# EAGLE design DevControl (EAGLE 9.4.2)
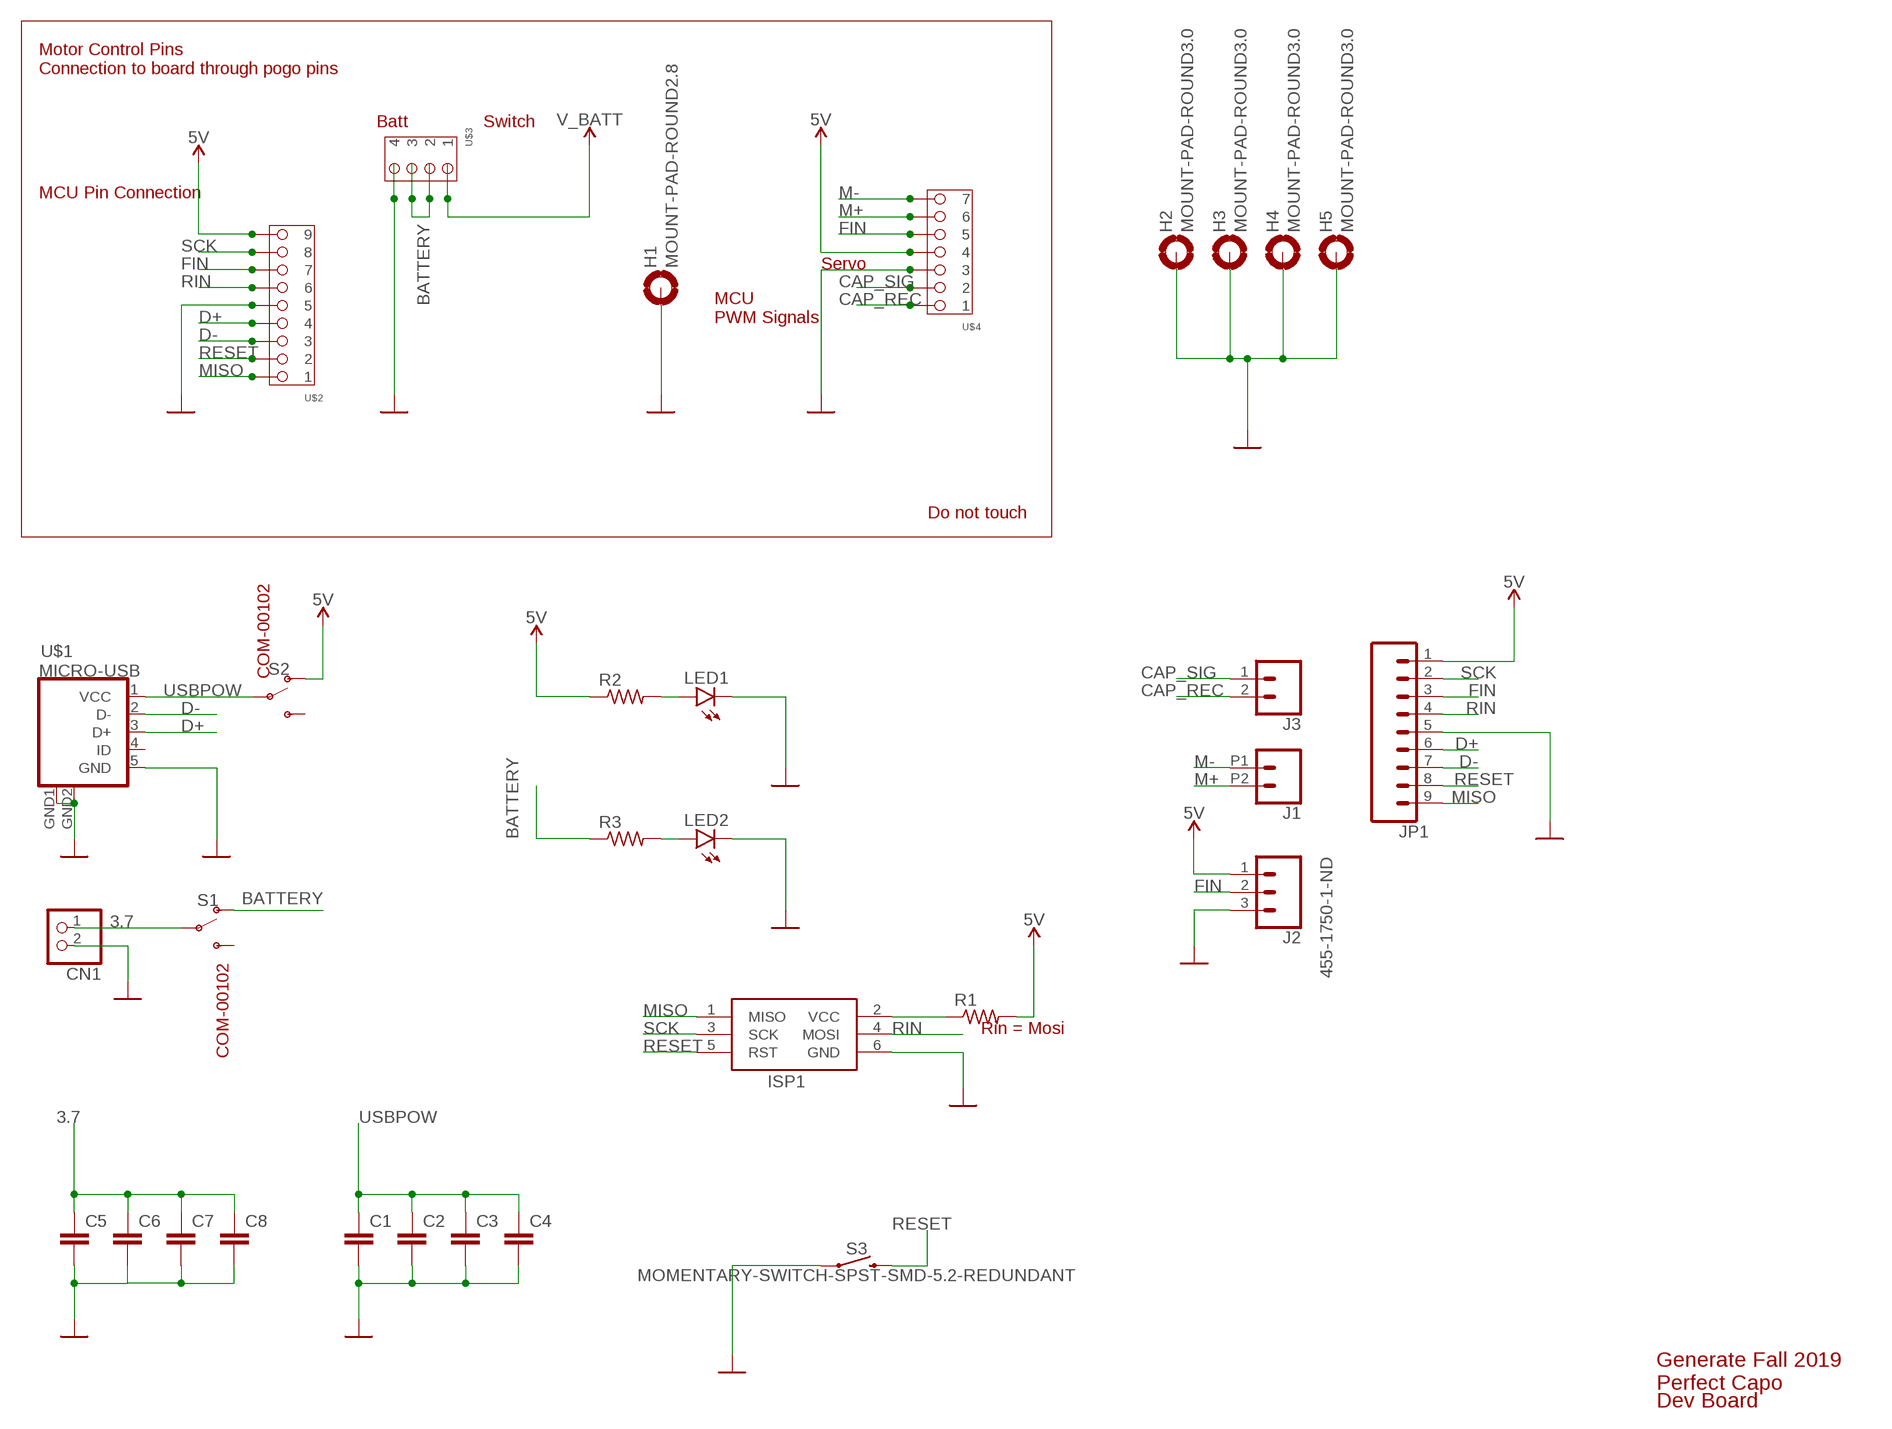
[diagram p0: schematic, sheet 1]

## Parts
C1  C-EUC0805  [C0805]
C2  C-EUC0805  [C0805]
C3  C-EUC0805  [C0805]
C4  C-EUC0805  [C0805]
C5  C-EUC0805  [C0805]
C6  C-EUC0805  [C0805]
C7  C-EUC0805  [C0805]
C8  C-EUC0805  [C0805]
CN1  JST_2PIN-SMT-RA  [JST-PH-2-SMT-RA]
H1  MOUNT-PAD-ROUND2.8  [2,8-PAD]
H2  MOUNT-PAD-ROUND3.0  [3,0-PAD]
H3  MOUNT-PAD-ROUND3.0  [3,0-PAD]
H4  MOUNT-PAD-ROUND3.0  [3,0-PAD]
H5  MOUNT-PAD-ROUND3.0  [3,0-PAD]
ISP1  AVRISP-6  [AVRISP]
J1  CONN_022.54MM_SCREWTERM  [1X02_2.54_SCREWTERM]
J2  455-1750-1-ND  CONN_03  [1X03]
J3  CONN_02  [1X02]
JP1  CONN_09  [1X09]
LED1  LEDCHIPLED_0805  [CHIPLED_0805]
LED2  LEDCHIPLED_0805  [CHIPLED_0805]
R1  R-US_R0805  [R0805]
R2  R-US_R0805  [R0805]
R3  R-US_R0805  [R0805]
S1  SWITCH-SPDT-PTH-11.6X4.0MM  [SWITCH_SPDT_PTH_11.6X4.0MM]
S2  SWITCH-SPDT-PTH-11.6X4.0MM  [SWITCH_SPDT_PTH_11.6X4.0MM]
S3  MOMENTARY-SWITCH-SPST-SMD-5.2-REDUNDANT  [TACTILE_SWITCH_SMD_5.2MM]
U$1  MICRO-USB  [MICRO-USB]
U$2  POGO-1X9  [POGO-1X9]
U$3  POGO-1X4  [POGO-1X4]
U$4  POGO-1X7  [POGO-1X7]

## Nets
3.7: C5.1 C6.1 C7.1 C8.1 CN1.1 S1.2(P)
5V: J2.1 JP1.1 R1.2 R2.1 S2.1(O) U$2.P$9 U$4.P$4
BATTERY: R3.1 S1.1(O) U$3.P$2 U$3.P$3
CAP_REC: J3.2 U$4.P$1
CAP_SIG: J3.1 U$4.P$2
D+: JP1.6 U$1.3(D+) U$2.P$4
D-: JP1.7 U$1.2(D-) U$2.P$3
FIN: J2.2 JP1.3 U$2.P$7 U$4.P$5
GND: C1.2 C2.2 C3.2 C4.2 C5.2 C6.2 C7.2 C8.2 CN1.2 H1.B2,8(MOUNT) H2.B3,0(MOUNT) H3.B3,0(MOUNT) H4.B3,0(MOUNT) H5.B3,0(MOUNT) ISP1.6(GND) J2.3 JP1.5 LED1.C LED2.C S3.1 S3.2 U$1.5(GND) U$1.GND1(GND) U$1.GND2(GND) U$2.P$5 U$3.P$4 U$4.P$3
M+: J1.P2 U$4.P$6
M-: J1.P1 U$4.P$7
MISO: ISP1.1(MISO) JP1.9 U$2.P$1
N$1: ISP1.2(VCC) R1.1
N$2: LED1.A R2.2
N$6: LED2.A R3.2
RESET: ISP1.5(RST) JP1.8 S3.3 S3.4 U$2.P$2
RIN: ISP1.4(MOSI) JP1.4 U$2.P$6
SCK: ISP1.3(SCK) JP1.2 U$2.P$8
USBPOW: C1.1 C2.1 C3.1 C4.1 S2.2(P) U$1.1(VCC)
V_BATT: U$3.P$1
Unconnected: S1.3(S) S2.3(S) U$1.4(ID)

## Notes on the sheet
- Motor Control Pins
  Connection to board through pogo pins
- Batt | Switch
- MCU Pin Connection
- Servo
- MCU
  PWM Signals
- Do not touch
- COM-00102
- COM-00102
- Rin = Mosi
- Generate Fall 2019
  Perfect Capo
- Dev Board

## Library data of the parts
C1-C8 = rcl:C-EU: CAPACITOR, European symbol; SPICEPREFIX: C
CN1 = adafruit:JST_2PIN: JST 2-Pin Connectors of various flavors SMT-RA (S2B-PH-SM4) 4UConnector #17311 SMT (B2B-PH-SM4) THM-RA (S2B-PH) THM (B2B-PH)
H1-H5 = holes:MOUNT-PAD-ROUND: MOUNTING PAD, round
ISP1 = adafruit:AVRISP: AVR ISP HEADER Standard 6 pin header for AVR programming
J1 J3 = SparkFun-Connectors:CONN_02: Multi connection point. Often used as Generic Header-pin footprint for 0.1 inch spaced/style header connections On any of the 0.1 inch spaced packages, you can populate with these: Break Away Headers - Straight <https://www.sparkfun.com/products/116> (PRT-00116) Break Away Male Headers - Right Angle <https://www.sparkfun.com/products/553> (PRT-00553) Female Headers <https://www.sparkfun.com/products/115> (PRT-00115) Break Away Headers - Machine Pin <https://www.sparkfun.com/products/117> (PRT-00117) Break Away Female Headers - Swiss Machine Pin <https://www.sparkfun.com/products/743> (PRT-00743) For SCREWTERMINALS and SPRING TERMINALS visit here: Screw Terimnals on SparkFun.com <https://www.sparkfun.com/search/results?term=Screw+Terminals> (5mm/3.5mm/2.54mm spacing) This device is also useful as a general connection point to wire up your design to another part of your project. Our various solder wires solder well into these plated through hole pads. Hook-Up Wire - Assortment (Stranded, 22 AWG) <https://www.sparkfun.com/products/11375> (PRT-11375) Hook-Up Wire - Assortment (Solid Core, 22 AWG) <https://www.sparkfun.com/products/11367> (PRT-11367) View the entire wire category on our website here <https://www.sparkfun.com/categories/141> Special notes: Molex polarized connector foot print use with: PRT-08233 with associated crimp pins and housings. 2.54_SCREWTERM for use with PRT-10571. 3.5mm Screw Terminal footprints for PRT-08084 5mm Screw Terminal footprints for use with PRT-08432
J2 = SparkFun-Connectors:CONN_03: Multi connection point. Often used as Generic Header-pin footprint for 0.1 inch spaced/style header connections On any of the 0.1 inch spaced packages, you can populate with these: Break Away Headers - Straight <https://www.sparkfun.com/products/116> (PRT-00116) Break Away Male Headers - Right Angle <https://www.sparkfun.com/products/553> (PRT-00553) Female Headers <https://www.sparkfun.com/products/115> (PRT-00115) Break Away Headers - Machine Pin <https://www.sparkfun.com/products/117> (PRT-00117) Break Away Female Headers - Swiss Machine Pin <https://www.sparkfun.com/products/743> (PRT-00743) Stackable Header - 3 Pin (Female, 0.1") <https://www.sparkfun.com/products/13875> (PRT-13875) For SCREWTERMINALS and SPRING TERMINALS visit here: Screw Terimnals on SparkFun.com <https://www.sparkfun.com/search/results?term=Screw+Terminals> (5mm/3.5mm/2.54mm spacing) This device is also useful as a general connection point to wire up your design to another part of your project. Our various solder wires solder well into these plated through hole pads. Hook-Up Wire - Assortment (Stranded, 22 AWG) <https://www.sparkfun.com/products/11375> (PRT-11375) Hook-Up Wire - Assortment (Solid Core, 22 AWG) <https://www.sparkfun.com/products/11367> (PRT-11367) View the entire wire category on our website here <https://www.sparkfun.com/categories/141> Special notes: Molex polarized connector foot print use with SKU : PRT-08232 with associated crimp pins and housings.; PROD_ID: XXX-00000
JP1 = SparkFun-Connectors:CONN_09: Multi connection point. Often used as Generic Header-pin footprint for 0.1 inch spaced/style header connections On any of the 0.1 inch spaced packages, you can populate with these: Break Away Headers - Straight <https://www.sparkfun.com/products/116> (PRT-00116) Break Away Male Headers - Right Angle <https://www.sparkfun.com/products/553> (PRT-00553) Female Headers <https://www.sparkfun.com/products/115> (PRT-00115) Break Away Headers - Machine Pin <https://www.sparkfun.com/products/117> (PRT-00117) Break Away Female Headers - Swiss Machine Pin <https://www.sparkfun.com/products/743> (PRT-00743) For SCREWTERMINALS and SPRING TERMINALS visit here: Screw Terimnals on SparkFun.com <https://www.sparkfun.com/search/results?term=Screw+Terminals> (5mm/3.5mm/2.54mm spacing) This device is also useful as a general connection point to wire up your design to another part of your project. Our various solder wires solder well into these plated through hole pads. Hook-Up Wire - Assortment (Stranded, 22 AWG) <https://www.sparkfun.com/products/11375> (PRT-11375) Hook-Up Wire - Assortment (Solid Core, 22 AWG) <https://www.sparkfun.com/products/11367> (PRT-11367) View the entire wire category on our website here <https://www.sparkfun.com/categories/141> Special notes: Molex polarized connector foot print use with SKU : PRT-08231 with associated crimp pins and housings. 1MM SMD Version SKU: PRT-10208 NOTES ON THE VARIANTS LOCK and LOCK_LONGPADS... This footprint was designed to help hold the alignment of a through-hole component (i.e. 6-pin header) while soldering it into place. You may notice that each hole has been shifted either up or down by 0.005 of an inch from it's more standard position (which is a perfectly straight line). This slight alteration caused the pins (the squares in the middle) to touch the edges of the holes. Because they are alternating, it causes a "brace" to hold the component in place. 0.005 has proven to be the perfect amount of "off-center" position when using our standard breakaway headers. Although looks a little odd when you look at the bare footprint, once you have a header in there, the alteration is very hard to notice. Also,if you push a header all the way into place, it is covered up entirely on the bottom side.
LED1 LED2 = led:LED: LED OSRAM: - CHIPLED LG R971, LG N971, LY N971, LG Q971, LY Q971, LO R971, LY R971 LH N974, LH R974 LS Q976, LO Q976, LY Q976 LO Q996 - Hyper CHIPLED LW Q18S LB Q993, LB Q99A, LB R99A - SideLED LS A670, LO A670, LY A670, LG A670, LP A670 LB A673, LV A673, LT A673, LW A673 LH A674 LY A675 LS A676, LA A676, LO A676, LY A676, LW A676 LS A679, LY A679, LG A679 - Hyper Micro SIDELED® LS Y876, LA Y876, LO Y876, LY Y876 LT Y87S - SmartLED LW L88C, LW L88S LB L89C, LB L89S, LG L890 LS L89K, LO L89K, LY L89K LS L896, LA L896, LO L896, LY L896 - TOPLED LS T670, LO T670, LY T670, LG T670, LP T670 LSG T670, LSP T670, LSY T670, LOP T670, LYG T670 LG T671, LOG T671, LSG T671 LB T673, LV T673, LT T673, LW T673 LH T674 LS T676, LA T676, LO T676, LY T676, LB T676, LH T676, LSB T676, LW T676 LB T67C, LV T67C, LT T67C, LS T67K, LO T67K, LY T67K, LW E67C LS E67B, LA E67B, LO E67B, LY E67B, LB E67C, LV E67C, LT E67C LW T67C LS T679, LY T679, LG T679 LS T770, LO T770, LY T770, LG T770, LP T770 LB T773, LV T773, LT T773, LW T773 LH T774 LS E675, LA E675, LY E675, LS T675 LS T776, LA T776, LO T776, LY T776, LB T776 LHGB T686 LT T68C, LB T68C - Hyper Mini TOPLED® LB M676 - Mini TOPLED Santana® LG M470 LS M47K, LO M47K, LY M47K Source: http://www.osram.convergy.de LUXEON: - LUMILED® LXK2-PW12-R00, LXK2-PW12-S00, LXK2-PW14-U00, LXK2-PW14-V00 LXK2-PM12-R00, LXK2-PM12-S00, LXK2-PM14-U00 LXK2-PE12-Q00, LXK2-PE12-R00, LXK2-PE12-S00, LXK2-PE14-T00, LXK2-PE14-U00 LXK2-PB12-K00, LXK2-PB12-L00, LXK2-PB12-M00, LXK2-PB14-N00, LXK2-PB14-P00, LXK2-PB14-Q00 LXK2-PR12-L00, LXK2-PR12-M00, LXK2-PR14-Q00, LXK2-PR14-R00 LXK2-PD12-Q00, LXK2-PD12-R00, LXK2-PD12-S00 LXK2-PH12-R00, LXK2-PH12-S00 LXK2-PL12-P00, LXK2-PL12-Q00, LXK2-PL12-R00 Source: www.luxeon.com KINGBRIGHT: KA-3528ASYC Source: www.kingbright.com
R1-R3 = rcl:R-US_: RESISTOR, American symbol; SPICEPREFIX: R
S1 S2 = SparkFun-Switches:SWITCH-SPDT: Single Pole, Double Throw (SPDT) Switch Single-pole, double-throw (SPDT) switch. Variant Overview SMD-AYZ0202 Surface Mount DPDT Switch <https://www.sparkfun.com/products/597> (COM-00597) Used on e.g. LilyPad Arduino USB - ATmega32U4 Board <https://www.sparkfun.com/products/12049> PTH-11.6X4.0MM SPDT Mini Power Switch <https://www.sparkfun.com/products/102> (COM-00102) Used on e.g. SparkFun Simon Says - Through-Hole Soldering Kit <https://www.sparkfun.com/products/10547> (KIT-10547) PTH-11.6X4.0MM-KIT KIT version of SPDT Mini Power Switch - Simplifies soldering by removing tStop of switch pins - only one side can be soldered. PTH-11.6X4.0MM-LOCK LOCK version of SPDT Mini Power Switch - Offset pins hold switch in place for easier soldering. SMD-RIGHT-ANGLE Surface Mount Right Angle Switch <https://www.sparkfun.com/products/10860> (COM-10860) Used on e.g. SparkFun ESP8266 Thing <https://www.sparkfun.com/products/13231>; PROD_ID: SWCH-08261; SF_SKU: COM-00102
S3 = SparkFun-Switches:MOMENTARY-SWITCH-SPST: Momentary Switch (Pushbutton) - SPST Normally-open (NO) SPST momentary switches (buttons, pushbuttons). Variants PTH-12MM - 12mm square, through-hole Momentary Pushbutton Switch - 12mm Square <https://www.sparkfun.com/products/9190> (COM-09190) PTH-6.0MM, PTH-6.0MM-KIT - 6.0mm square, through-hole Mini Pushbutton Switch <https://www.sparkfun.com/products/97> (COM-00097) KIT package intended for soldering kit's - only one side of pads' copper is exposed. PTH-RIGHT-ANGLE-KIT - Right-angle, through-hole Right Angle Tactile Button <https://www.sparkfun.com/products/10791> - Used on SparkFun BigTime Watch Kit <https://www.sparkfun.com/products/11734> SMD-12MM - 12mm square, surface-mount Tactile Button - SMD (12mm) <https://www.sparkfun.com/products/12993> (COM-12993) Used on SparkFun PicoBoard <https://www.sparkfun.com/products/11888> SMD-4.5MM - 4.5mm Square Trackball Switch Used on SparkFun Blackberry Trackballer Breakout <https://www.sparkfun.com/products/13169> SMD-4.6MMX2.8MM - 4.60mm x 2.80mm, surface mount Used on SparkFun SAMD21 Mini Breakout <https://www.sparkfun.com/products/13664> SMD-5.2MM, SMD-5.2-REDUNDANT - 5.2mm square, surface-mount Mini Pushbutton Switch - SMD <https://www.sparkfun.com/products/8720> (COM-08720) Used on Arduino Pro Mini <https://www.sparkfun.com/products/11114> REDUNDANT package connects both switch circuits together SMD-6.0X3.5MM - 6.0 x 3.5mm, surface mount Momentary Reset Switch SMD <https://www.sparkfun.com/products/8229> (COM-08229) SMD-6.2MM-TALL - 6.2mm square, surface mount Tactile Button - SMD (6mm) <https://www.sparkfun.com/products/12992> Used on SparkFun Digital Sandbox <https://www.sparkfun.com/products/12651> SMD-RIGHT-ANGLE - Right-angle, surface mount Used on SparkFun Block for Intel® Edison - Arduino <https://www.sparkfun.com/products/13036>; PROD_ID: SWCH-08247; SF_SKU: COM-08720
U$1 = MicroUSB:MICRO-USB: Micro USB B connector
U$2 = Nick's Personal Part:POGO-1X9
U$3 = Nick's Personal Part:POGO-1X4
U$4 = Nick's Personal Part:POGO-1X7

## Board
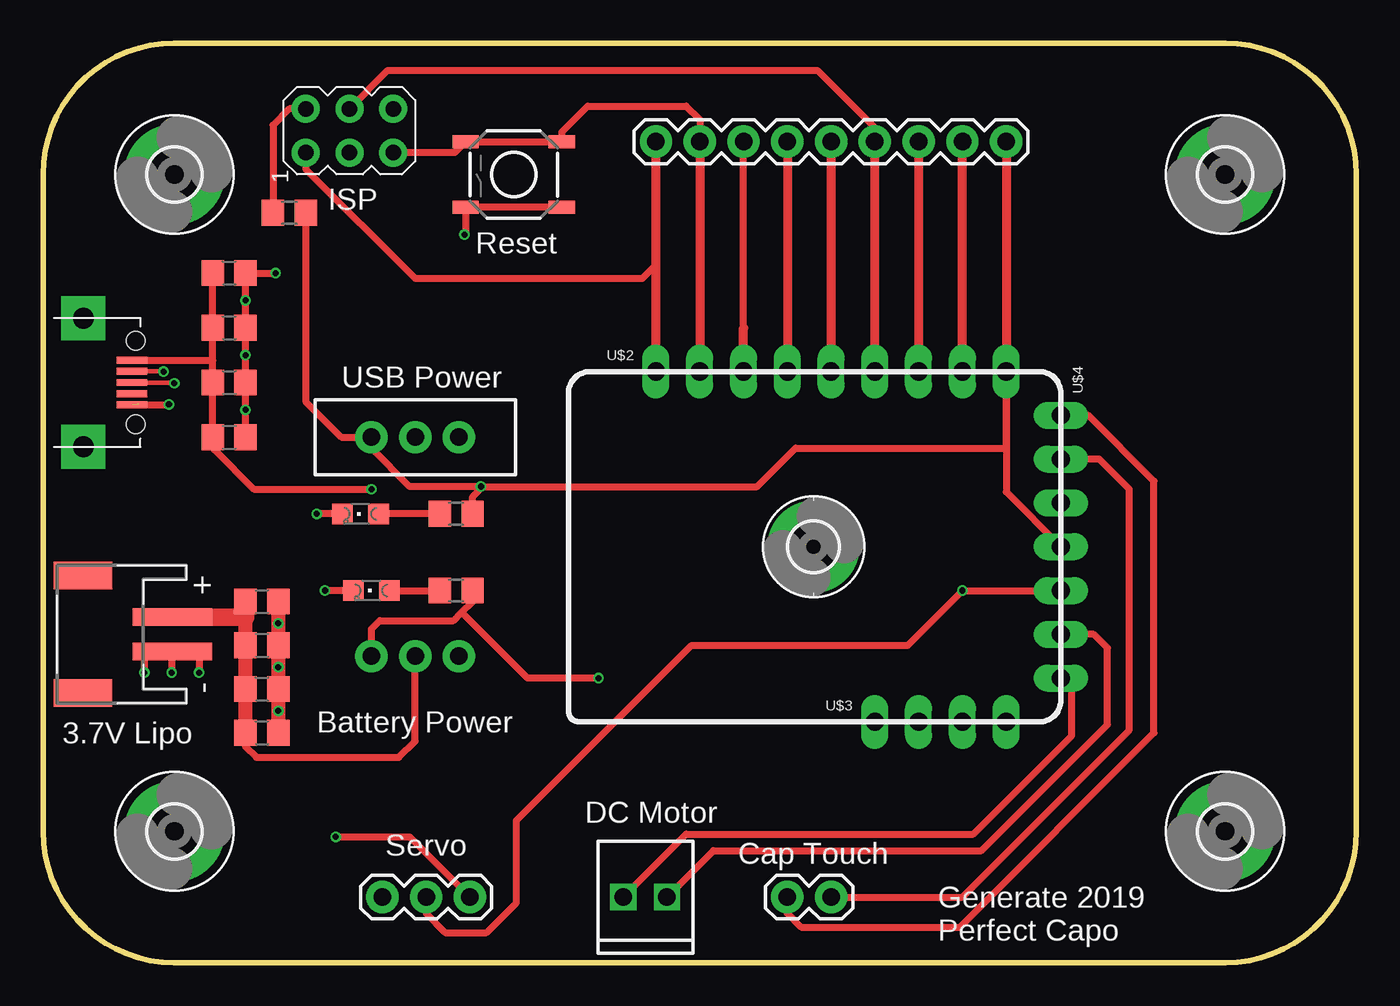
[diagram p1: board, top side]
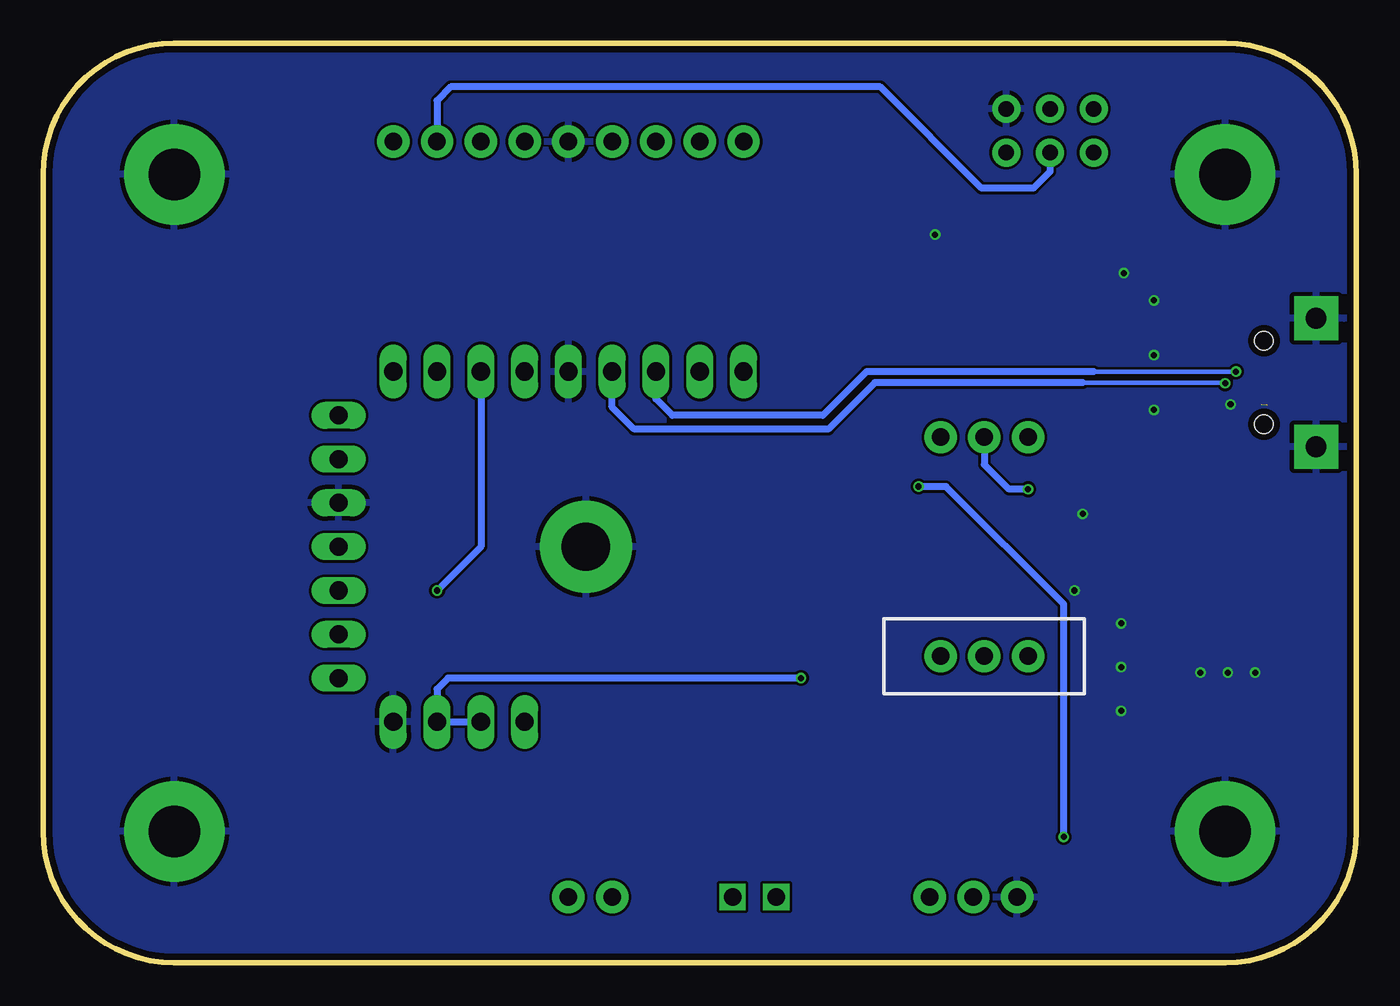
[diagram p2: board, bottom side, seen from below]

Size 76.2 x 53.34 mm. Coordinates in mm from the lower left corner, seen from the top.
Outline: 7.62,0 arc-90 0,7.62 0,45.72 arc-90 7.62,53.34 68.58,53.34 arc-90 76.2,45.72 76.2,7.62 arc-90 68.58,0 7.62,0
Copper layers (1*16): Top 0.035559375mm / dielectric 1.6mm / Bottom 0.035559375mm
Design rules "oshpark-2layer": minimum track width 6mil, minimum drill 10mil, track to track 6mil, track to pad 6mil, pad to pad 6mil, via to via 6mil, smd to smd 6mil, copper to edge 15mil, drill to drill 6mil, minimum pad ring 5mil, minimum via ring 5mil, stop-mask expansion 2.5mil, vias tented up to drill 0mil, thermal gap 10mil

### Footprints (pad centres in the part's own frame; a part is rotated, then mirrored left to right if it is on the bottom)
C0805 = smd 1.3 x 1.5: 1 -0.95,0; 2 0.95,0
JST-PH-2-SMT-RA = smd 1 x 4.6: 1 1,-3.7; 2 -1,-3.7 | smd 1.6 x 3.4: NC1 -3.4,1.5; NC2 3.4,1.5
2,8-PAD = drill 2.8 pad 5.334: B2,8 0,0
3,0-PAD = drill 3 pad 5.842: B3,0 0,0
AVRISP = drill 0.9 pad 1.626: 1 -1.27,2.54; 2 1.27,2.54; 3 -1.27,0; 4 1.27,0; 5 -1.27,-2.54; 6 1.27,-2.54
1X02_2.54_SCREWTERM = drill 1.016 square: P1 2.54,0; P2 0,0
1X03 = drill 1.016 pad 1.88: 1 0,0; 2 2.54,0; 3 5.08,0
1X02 = drill 1.016 pad 1.88: 1 0,0; 2 2.54,0
1X09 = drill 1.016 pad 1.88: 1 0,0; 2 2.54,0; 3 5.08,0; 4 7.62,0; 5 10.16,0; 6 12.7,0; 7 15.24,0; 8 17.78,0; 9 20.32,0
CHIPLED_0805 = smd 1.2 x 1.2: A 0,-1.05; C 0,1.05
R0805 = smd 1.3 x 1.5: 1 -0.95,0; 2 0.95,0
SWITCH_SPDT_PTH_11.6X4.0MM = drill 1.016 pad 1.88: 1 0,2.54; 2 0,0; 3 0,-2.54
TACTILE_SWITCH_SMD_5.2MM = smd 1.524 x 0.762: 1 -2.794,1.905; 2 2.794,1.905; 3 -2.794,-1.905; 4 2.794,-1.905
MICRO-USB = smd 0.4 x 1.75: 1 -1.3,4.525; 2 -0.65,4.525; 3 0,4.525; 4 0.65,4.525; 5 1.3,4.525 | drill 1.2 pad 2.54 square: GND1 -3.725,1.7; GND2 3.725,1.7 | hole 1.05: -2.425,4.73; 2.425,4.73
POGO-1X9 = drill 1.05 long: P$1 0,0; P$2 2.54,0; P$3 5.08,0; P$4 7.62,0; P$5 10.16,0; P$6 12.7,0; P$7 15.24,0; P$8 17.78,0; P$9 20.32,0
POGO-1X4 = drill 1.05 long: P$1 0,0; P$2 2.54,0; P$3 5.08,0; P$4 7.62,0
POGO-1X7 = drill 1.05 long: P$1 0,0; P$2 2.54,0; P$3 5.08,0; P$4 7.62,0; P$5 10.16,0; P$6 12.7,0; P$7 15.24,0

### Placement (x,y rotation side)
C1  10.79,40.01 0 top
C2  10.79,36.83 0 top
C3  10.79,33.66 0 top
C4  10.79,30.48 0 top
C5  12.7,20.95 0 top
C6  12.7,18.41 0 top
C7  12.7,15.88 0 top
C8  12.7,13.34 0 top
CN1  3.81,19.05 90 top
H1  44.7,24.13 0 top
H2  68.58,7.62 0 top
H3  68.58,45.72 0 top
H4  7.62,45.72 0 top
H5  7.62,7.62 0 top
ISP1  17.78,48.26 90 top
J1  36.2,3.81 180 top
J2  24.77,3.81 180 top
J3  45.72,3.81 180 top
JP1  55.88,47.62 180 top
LED1  18.41,26.04 90 top
LED2  19.05,21.59 90 top
R1  14.29,43.5 0 top
R2  23.97,26.04 180 top
R3  23.97,21.59 180 top
S1  21.59,17.78 270 bottom
S2  21.59,30.48 90 top
S3  27.3,45.72 180 top
U$1  0.63,33.66 270 top
U$2  35.56,34.29 0 top
U$3  48.26,13.97 0 top
U$4  59.05,31.75 270 top

### Tracks (layer width: path | path; a pad name or v marks a point on that pad's centre or on a via)
3.7
  Top 0.406: C8.1 11.75,12.54 12.38,11.91 20.64,11.91 21.59,12.86 S1.2
  Top 0.813: C8.1 C7.1 C6.1 C5.1
  Top 1.016: CN1.1 11.75,20.05 C5.1
5V  (via drill 0.35)
  Top 0.406: U$4.P$4 55.88,27.3 U$2.P$9 55.88,29.84 43.66,29.84 41.43,27.62 25.5,27.62 | R1.2 15.24,32.55 17.3,30.48 S2.1 19.05,29.84 21.27,27.62 v25.4,27.62 25.5,27.62 | R2.1 24.92,27.04 25.5,27.62 | v16.99,7.3 21.27,7.3 J2.1
  Top 0.508: JP1.1 U$2.P$9
  Bottom 0.406: v16.99,7.3 16.99,20.8 23.81,27.62 v25.4,27.62
BATTERY  (via drill 0.35)
  Top 0.406: S1.1 19.05,19.37 19.53,19.84 23.81,19.84 24.29,20.32 | 24.29,20.32 24.92,20.95 R3.1 | 24.29,20.32 28.1,16.51 v32.23,16.51
  Bottom 0.406: v32.23,16.51 52.7,16.51 53.34,15.88 U$3.P$3 U$3.P$2
CAP_REC
  Top 0.406: J3.2 43.18,2.86 43.97,2.06 53.18,2.06 64.45,13.34 64.45,27.94 60.64,31.75 U$4.P$1
CAP_SIG
  Top 0.406: J3.1 53.34,3.81 63.02,13.49 63.02,27.46 61.28,29.21 U$4.P$2 59.21,29.21
D+  (via drill 0.35)
  Top 0.254: U$1.3 7.57,33.66 v7.62,33.61
  Top 0.406: U$2.P$4 43.18,33.18
  Top 0.508: JP1.6 U$2.P$4
  Bottom 0.254: 15.88,33.66 7.66,33.66 v7.62,33.61
  Bottom 0.406: 15.88,33.66 27.94,33.66 30.64,30.96 41.91,30.96 43.18,32.23 U$2.P$4
D-  (via drill 0.35)
  Top 0.254: U$1.2 6.97,34.3 v6.98,34.29
  Top 0.406: 40.64,48.26 JP1.7 40.64,36.83
  Top 0.508: U$2.P$3 40.64,36.83
  Bottom 0.254: v6.98,34.29 15.24,34.29
  Bottom 0.406: 15.24,34.29 28.42,34.29 30.96,31.75 39.69,31.75 40.64,32.7 U$2.P$3
FIN  (via drill 0.35)
  Top 0.406: J2.2 22.22,2.86 23.34,1.75 25.72,1.75 27.46,3.49 27.46,8.25 37.62,18.41 50.16,18.41 v53.34,21.59 U$4.P$5 | U$2.P$7 50.8,33.5
  Top 0.508: JP1.3 U$2.P$7
  Bottom 0.406: U$2.P$7 50.8,24.13 v53.34,21.59
GND  (via drill 0.35)  (1 unrouted)
  Top 0.152: C8.2 13.65,12.86 | 5.53,32.38 5.56,32.35 | C5.2 13.81,20.8 | C7.2 13.81,15.72
  Top 0.406: CN1.2 7.46,18 v7.46,16.83 | CN1.2 5.98,18.05 5.87,17.94 v5.87,16.83 | CN1.2 8.94,18.05 9.05,17.94 v9.05,16.83 | 5.56,32.35 7.27,32.35 v7.3,32.38 | C4.2 v11.74,32.07 C3.2 v11.74,35.24 C2.2 v11.74,38.42 C1.2 v13.49,40.01 | S3.1 S3.2 24.51,42.29 v24.45,42.23 | LED1.C v15.88,26.04 | LED2.C v16.35,21.59
  Top 0.508: JP1.5 U$2.P$5
  Top 0.813: C5.2 v13.65,19.69 C6.2 v13.65,17.14 C7.2 v13.65,14.61 C8.2
  Bottom 0.152: v13.65,14.61 13.81,14.45
  pour Bottom: -10.8,63.18 87.31,63.18 87.31,-5.08 -10.8,-5.08
M+
  Top 0.406: J1.P2 38.89,6.51 54.45,6.51 61.75,13.81 61.75,18.26 60.96,19.05 U$4.P$6
M-
  Top 0.406: J1.P1 37.31,7.46 53.97,7.46 59.69,13.18 59.69,15.88 U$4.P$7
MISO
  Top 0.406: ISP1.1 15.24,46.04 21.59,39.69 34.77,39.69 35.56,40.48
  Top 0.508: U$2.P$1 35.56,40.48 JP1.9
N$1
  Top 0.406: ISP1.2 14.29,49.53 13.33,48.58 13.33,43.97 13.34,43.97 R1.1
N$2
  Top 0.406: R2.2 LED1.A
N$6
  Top 0.406: LED2.A R3.2
RESET
  Top 0.406: 24.51,47.69 S3.4 | JP1.8 38.1,48.9 37.31,49.69 31.59,49.69 30.1,48.2 S3.3 S3.4 | S3.4 23.88,46.99 ISP1.5
  Top 0.508: JP1.8 U$2.P$2
RIN
  Top 0.406: 48.26,47.78 JP1.4 | ISP1.4 20,51.75 44.93,51.75 48.26,48.42 48.26,47.31
  Top 0.508: U$2.P$6 48.26,47.31 JP1.4
SCK
  Top 0.508: U$2.P$8 JP1.2
  Bottom 0.406: ISP1.3 17.78,45.88 18.73,44.93 21.75,44.93 27.62,50.8 52.55,50.8 53.34,50.01 JP1.2
USBPOW  (via drill 0.35)
  Top 0.406: 9.84,34.92 C3.1 C4.1 9.95,30.38 9.95,29.74 12.22,27.46 v19.05,27.46 | 9.84,34.92 C2.1 C1.1 | U$1.1 9.81,34.95 9.84,34.92
  Bottom 0.406: v19.05,27.46 20.16,27.46 21.59,28.89 S2.2

### Text on the board
tNames: ISP | Reset | USB Power | Battery Power | 3.7V Lipo | DC Motor | Servo | Cap Touch | Generate 2019 / Perfect Capo